# EAGLE schematic lc-meter-lm311 (EAGLE 5.07)
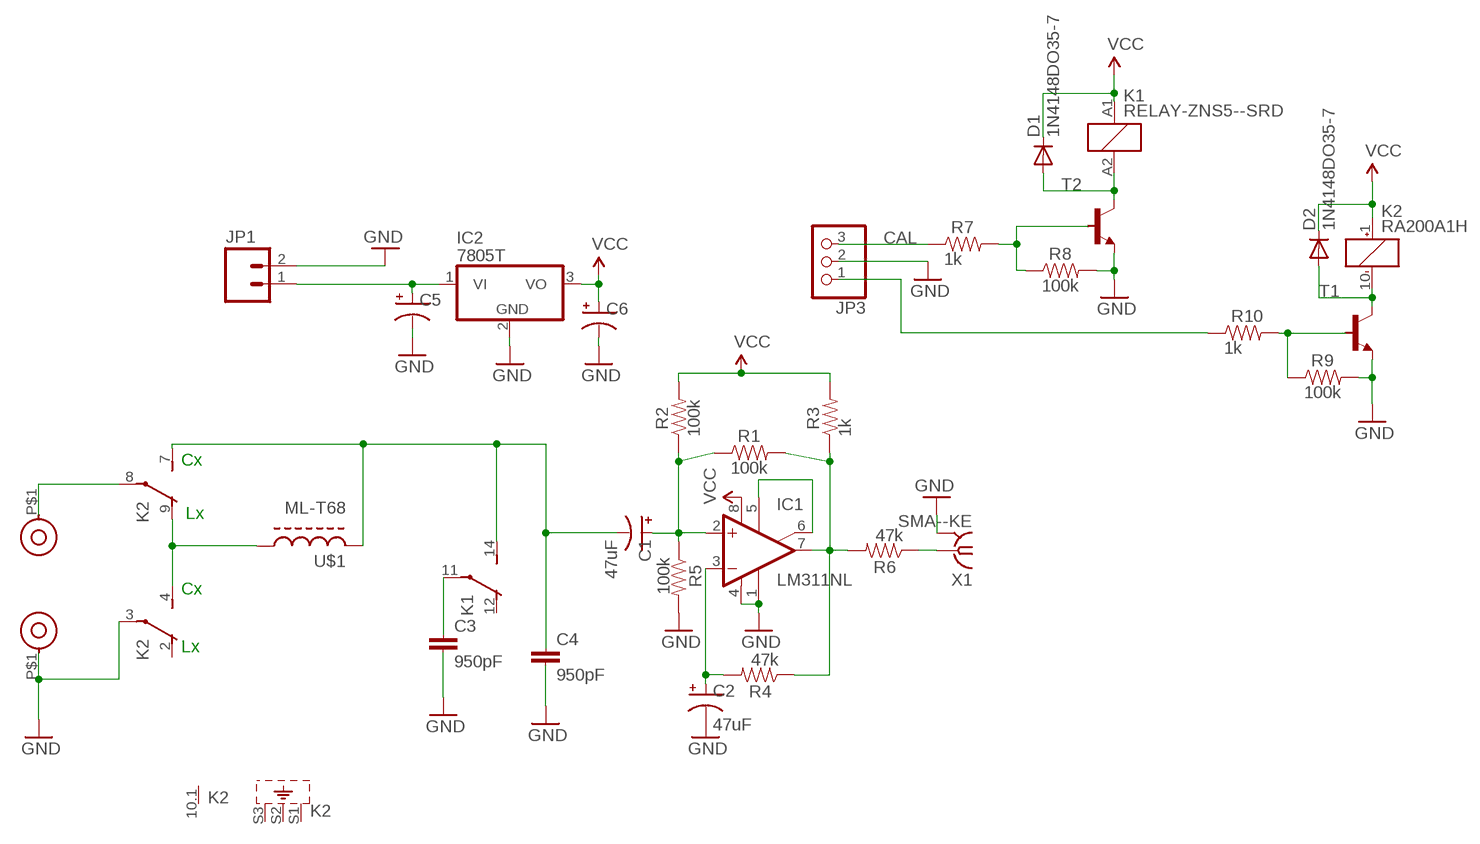
[diagram p0: schematic, sheet 1]

## Parts
C1  47uF  CAP_POL-CT6032  [CT6032]
C2  47uF  CAP_POL-CT6032  [CT6032]
C3  950pF  CAP-CB  [CB-1.3CM]
C4  950pF  CAP-CB  [CB-1.3CM]
C5  CAP_POLPTH1  [CPOL-RADIAL-100UF-25V]
C6  CAP_POLPTH1  [CPOL-RADIAL-100UF-25V]
D1  1N4148DO35-7  [DO35-7]
D2  1N4148DO35-7  [DO35-7]
IC1  LM311NL  [DIL-08]
IC2  7805T  [TO220H]
JP1  CON-02XH-V  [XH-1X2-LONG-LOCK-V]
JP3  PINHD-1X3PTH  [1X03]
K1  RELAY-ZNS5--SRD  [SRD-05]
K2  RA200A1H  [RA]
R1  100k  RESISTOR-R0805W  [R0805W]
R2  100k  RESISTOR-R0805W  [R0805W]
R3  1k  RESISTOR-R0805W  [R0805W]
R4  47k  RESISTOR-R0805W  [R0805W]
R5  100k  RESISTOR-R0805W  [R0805W]
R6  47k  RESISTOR-R0805W  [R0805W]
R7  1k  RESISTOR-R0805W  [R0805W]
R8  100k  RESISTOR-R0805W  [R0805W]
R9  100k  RESISTOR-R0805W  [R0805W]
R10  1k  RESISTOR-R0805W  [R0805W]
T1  -NPN-SOT23-BEC  [SOT23-BEC]
T2  -NPN-SOT23-BEC  [SOT23-BEC]
U$1  ML-T68  [T68-PIN2]
U$2  SOCK  [SOCK-5MM]
U$4  SOCK  [SOCK-5MM]
X1  SMA--KE  [SMA-KE]

## Nets
CAL: JP3.3 R7.1
GND: C2.- C3.2 C4.2 C5.2(-) C6.2(-) IC1.1(GND) IC1.4(V-) IC2.2(GND) JP1.2 JP3.2 K2.3(2:P) R5.2 R8.2 R9.2 T1.E T2.E U$2.P$1 X1.G@1(GND)
N$1: K2.8(3:P) U$4.P$1
N$2: C1.+ R1.1 R2.1 R5.1
N$3: C2.+ IC1.3(-IN) R4.2
N$4: IC1.7(OUT) R1.2 R3.1 R4.1 R6.2
N$5: IC1.5(ON) IC1.6(ON/STR)
N$6: D2.A K2.10(1:-) T1.C
N$7: C3.1 K1.11(2:P)
N$8: C1.- C4.1 K1.14(2:S) K2.7(3:S) U$1.4
N$9: R6.1 X1.1
N$10: D1.A K1.A2 T2.C
N$11: R7.2 R8.1 T2.B
N$12: K2.4(2:S) K2.9(3:O) U$1.3
N$14: C5.1(+) IC2.1(VI) JP1.1
N$15: R9.1 R10.2 T1.B
N$16: JP3.1 R10.1
VCC: C6.1(+) D1.C D2.C IC1.8(V+) IC2.3(VO) K1.A1 K2.1(1:+) R2.2 R3.2
Unconnected: IC1.2(+IN) K1.12(2:O) K2.2(2:O) K2.10.1(4:-) K2.S1(S1:SH) K2.S2(S1:SH) K2.S3(S1:SH)

## Notes on the sheet
- Cx
- Lx
- Cx
- Lx

## Power pins joined to a net without a drawn wire
GND: X1.G@2(GND) X1.G@3(GND) X1.G@4(GND)

## Library data of the parts
C1 C2 C5 C6 = digital-toy:CAP_POL: Capacitor Polarized These are standard SMD and PTH capacitors. Normally 10uF, 47uF, and 100uF in electrolytic and tantalum varieties. Always verify the external diameter of the through hole cap, it varies with capacity, voltage, and manufacturer. The EIA devices should be standard. PANASONIC_D size: 6.5mmx6.5mmx5.5mm, 100uf (taobao:6.3mmx5.5mm), same as CVL0605 153cvl0405 size: 4mmx4mmx5.5mm, 10uf (taobao:4mmx5.5mm) ct6032 typical 47uF Tantalum, comment by hyl.
C3 C4 = digital-toy:CAP: Capacitor Standard 0603 ceramic capacitor, and 0.1" leaded capacitor.
D1 D2 = diode:1N4148: DIODE high speed (Philips)
IC1 = digital-toy:LM311: COMPARATOR
IC2 = linear:78*: Positive VOLTAGE REGULATOR Source: http://cache.national.com/ds/LM/LM78L05.pdf http://www.fairchildsemi.com/ds/LM/LM7805.pdf
JP1 = digital-toy:CON-02: Header 2 Standard 2-pin 0.1" header. Use with straight break away headers (SKU : PRT-00116), right angle break away headers (PRT-00553), swiss pins (PRT-00743), machine pins (PRT-00117), and female headers (PRT-00115). Molex polarized connector foot print use with SKU : PRT-08233 with associated crimp pins and housings.
JP3 = digital-toy:PINHD-1X3: PIN HEADER
K1 = digital-toy:RELAY-ZNS5-*: Miniature Power PCB Relay SCHRACK 1pole 10 A Source: http://www.schrack.com/.. 5847.pdf
K2 = relay:RA2?*: MICROWAVE RELAY FOR ATTENUATOR CIRCUIT NAiS Source: http://www.mew-europe.com/.. en_ds_61308_0000.pdf
R1-R10 = digital-toy:RESISTOR: Resistor Basic schematic elements and footprints for 0603, 1206, and PTH 1/10th watt (small) resistors. digital-toy copy vertical mount of axial-0.3 from rcl.lbr : the 0207/xx 3W resistor: 0617/17, 0617/22, 0617V
T1 T2 = digital-toy:*-NPN-: NPN Transistror most of sot-23 use the pacages sot23-BEC, top C, left B, right E. by hyl, digital-toy. and to-92 use ebc(from-top) by hyl, digital-toy.
U$1 = dtoy-RF:ML
U$2 U$4 = digital-toy:SOCK
X1 = dtoy-RF:SMA-: SMA 50 Ohm End Launch Jack Receptacle - Round Contact Johnson Components Source: www.johnsoncomponents.com .. J502-ND.pdf